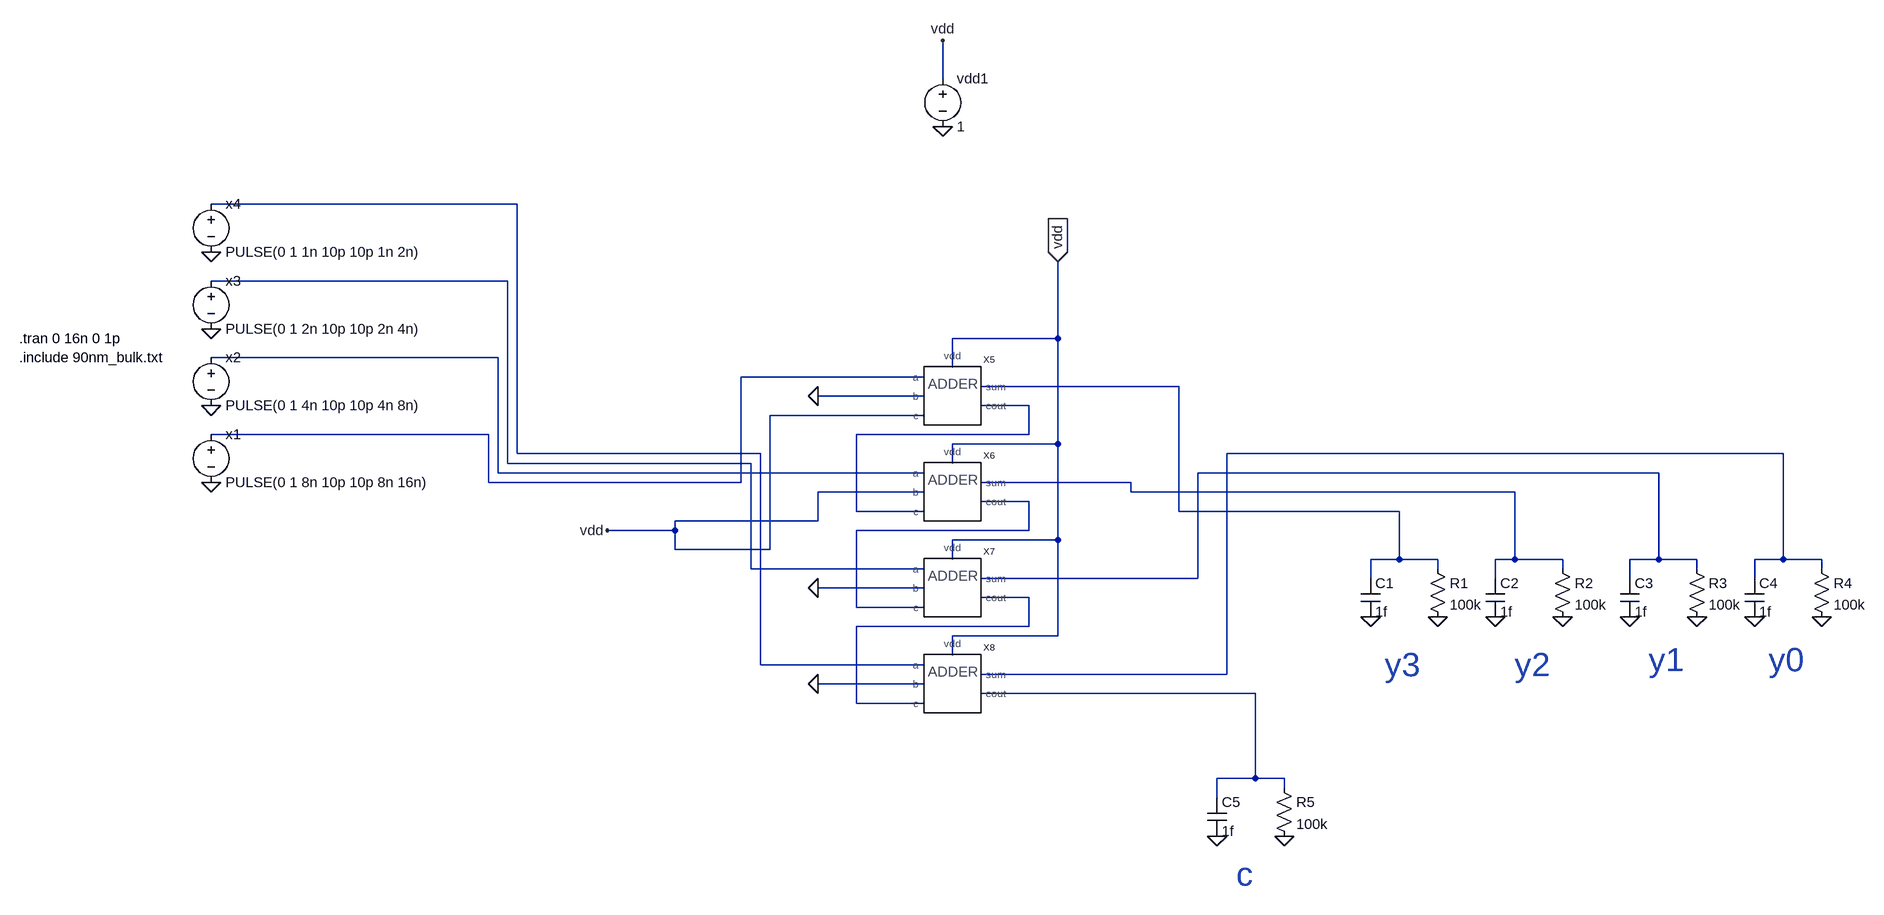
[diagram p0: schematic 4bitAdder-test.asc]
4bitAdder-test.asc, the LTspice schematic file:
Version 4
SHEET 1 4180 1316
WIRE 1552 -512 1552 -576
WIRE 576 -256 -96 -256
WIRE 560 -128 -96 -128
WIRE 1744 -32 1744 -160
WIRE 1744 -32 1568 -32
WIRE 544 0 -96 0
WIRE 1568 16 1568 -32
WIRE 1520 32 1216 32
WIRE 1952 48 1616 48
WIRE 1520 64 1344 64
WIRE 1696 80 1616 80
WIRE 1520 96 1264 96
WIRE 528 128 -96 128
WIRE 1696 128 1696 80
WIRE 1696 128 1408 128
WIRE 1744 144 1744 -32
WIRE 1744 144 1568 144
WIRE 576 160 576 -256
WIRE 1248 160 576 160
WIRE 2960 160 2032 160
WIRE 560 176 560 -128
WIRE 1232 176 560 176
WIRE 1568 176 1568 144
WIRE 544 192 544 0
WIRE 1520 192 544 192
WIRE 2752 192 1984 192
WIRE 528 208 528 128
WIRE 1216 208 1216 32
WIRE 1216 208 528 208
WIRE 1872 208 1616 208
WIRE 1520 224 1344 224
WIRE 1872 224 1872 208
WIRE 2512 224 1872 224
WIRE 1696 240 1616 240
WIRE 1408 256 1408 128
WIRE 1520 256 1408 256
WIRE 1952 256 1952 48
WIRE 2320 256 1952 256
WIRE 1344 272 1344 224
WIRE 1344 272 1056 272
WIRE 1056 288 1056 272
WIRE 1056 288 816 288
WIRE 1696 288 1696 240
WIRE 1696 288 1408 288
WIRE 1744 304 1744 144
WIRE 1744 304 1568 304
WIRE 1056 320 1056 288
WIRE 1264 320 1264 96
WIRE 1264 320 1056 320
WIRE 1568 336 1568 304
WIRE 2320 336 2320 256
WIRE 2320 336 2272 336
WIRE 2384 336 2320 336
WIRE 2512 336 2512 224
WIRE 2512 336 2480 336
WIRE 2592 336 2512 336
WIRE 2752 336 2752 192
WIRE 2752 336 2704 336
WIRE 2816 336 2752 336
WIRE 2960 336 2960 160
WIRE 2960 336 2912 336
WIRE 3024 336 2960 336
WIRE 1232 352 1232 176
WIRE 1520 352 1232 352
WIRE 2384 352 2384 336
WIRE 2592 352 2592 336
WIRE 2816 352 2816 336
WIRE 3024 352 3024 336
WIRE 1984 368 1984 192
WIRE 1984 368 1616 368
WIRE 2272 368 2272 336
WIRE 2480 368 2480 336
WIRE 2704 368 2704 336
WIRE 2912 368 2912 336
WIRE 1520 384 1344 384
WIRE 1696 400 1616 400
WIRE 1408 416 1408 288
WIRE 1520 416 1408 416
WIRE 1696 448 1696 400
WIRE 1696 448 1408 448
WIRE 1744 464 1744 304
WIRE 1744 464 1568 464
WIRE 1568 496 1568 464
WIRE 1248 512 1248 160
WIRE 1520 512 1248 512
WIRE 2032 528 2032 160
WIRE 2032 528 1616 528
WIRE 1520 544 1344 544
WIRE 2080 560 1616 560
WIRE 1408 576 1408 448
WIRE 1520 576 1408 576
WIRE 2080 720 2080 560
WIRE 2080 720 2016 720
WIRE 2128 720 2080 720
WIRE 2128 736 2128 720
WIRE 2016 752 2016 720
FLAG -96 80 0
FLAG -96 208 0
FLAG -96 -48 0
FLAG -96 -176 0
FLAG 1552 -432 0
FLAG 1552 -576 vdd
FLAG 816 288 vdd
FLAG 2272 432 0
FLAG 2384 432 0
FLAG 2480 432 0
FLAG 2592 432 0
FLAG 2704 432 0
FLAG 2816 432 0
FLAG 2912 432 0
FLAG 3024 432 0
FLAG 2016 816 0
FLAG 2128 816 0
FLAG 1744 -160 vdd
IOPIN 1744 -160 In
FLAG 1344 64 0
FLAG 1344 384 0
FLAG 1344 544 0
SYMBOL voltage -96 112 R0
WINDOW 123 0 0 Left 2
WINDOW 39 0 0 Left 2
SYMATTR InstName x1
SYMATTR Value PULSE(0 1 8n 10p 10p 8n 16n)
SYMBOL voltage -96 -16 R0
WINDOW 123 0 0 Left 2
WINDOW 39 0 0 Left 2
SYMATTR InstName x2
SYMATTR Value PULSE(0 1 4n 10p 10p 4n 8n)
SYMBOL voltage -96 -144 R0
WINDOW 123 0 0 Left 2
WINDOW 39 0 0 Left 2
SYMATTR InstName x3
SYMATTR Value PULSE(0 1 2n 10p 10p 2n 4n)
SYMBOL voltage -96 -272 R0
WINDOW 123 0 0 Left 2
WINDOW 39 0 0 Left 2
SYMATTR InstName x4
SYMATTR Value PULSE(0 1 1n 10p 10p 1n 2n)
SYMBOL voltage 1552 -528 R0
WINDOW 123 0 0 Left 2
WINDOW 39 0 0 Left 2
SYMATTR InstName vdd1
SYMATTR Value 1
SYMBOL res 2368 336 R0
SYMATTR InstName R1
SYMATTR Value 100k
SYMBOL cap 2256 368 R0
SYMATTR InstName C1
SYMATTR Value 1f
SYMBOL res 2576 336 R0
SYMATTR InstName R2
SYMATTR Value 100k
SYMBOL cap 2464 368 R0
SYMATTR InstName C2
SYMATTR Value 1f
SYMBOL res 2800 336 R0
SYMATTR InstName R3
SYMATTR Value 100k
SYMBOL cap 2688 368 R0
SYMATTR InstName C3
SYMATTR Value 1f
SYMBOL res 3008 336 R0
SYMATTR InstName R4
SYMATTR Value 100k
SYMBOL cap 2896 368 R0
SYMATTR InstName C4
SYMATTR Value 1f
SYMBOL res 2112 720 R0
SYMATTR InstName R5
SYMATTR Value 100k
SYMBOL cap 2000 752 R0
SYMATTR InstName C5
SYMATTR Value 1f
SYMBOL adder 1568 64 R0
SYMATTR InstName X5
SYMBOL adder 1568 224 R0
SYMATTR InstName X6
SYMBOL adder 1568 384 R0
SYMATTR InstName X7
SYMBOL adder 1568 544 R0
SYMATTR InstName X8
TEXT -416 0 Left 2 !.include 90nm_bulk.txt
TEXT -416 -32 Left 2 !.tran 0 16n 0 1p
TEXT 2936 504 Left 5 ;y0
TEXT 2736 504 Left 5 ;y1
TEXT 2512 512 Left 5 ;y2
TEXT 2296 512 Left 5 ;y3
TEXT 2048 880 Left 5 ;c

The netlist it stands for:
* 4bitAdder-test.asc
V§x1 N004 0 PULSE(0 1 8n 10p 10p 8n 16n)
V§x2 N003 0 PULSE(0 1 4n 10p 10p 4n 8n)
V§x3 N002 0 PULSE(0 1 2n 10p 10p 2n 4n)
V§x4 N001 0 PULSE(0 1 1n 10p 10p 1n 2n)
vdd1 vdd 0 1
R1 N005 0 100k
C1 N005 0 1f
R2 N009 0 100k
C2 N009 0 1f
R3 N008 0 100k
C3 N008 0 1f
R4 N007 0 100k
C4 N007 0 1f
R5 N012 0 100k
C5 N012 0 1f
XX5 N004 0 vdd vdd N005 N006 adder  ; pins a b c vdd sum cout
XX6 N003 vdd N006 vdd N009 N010 adder  ; pins a b c vdd sum cout
XX7 N002 0 N010 vdd N008 N011 adder  ; pins a b c vdd sum cout
XX8 N001 0 N011 vdd N007 N012 adder  ; pins a b c vdd sum cout
.include 90nm_bulk.txt
.tran 0 16n 0 1p
* y0
* y1
* y2
* y3
* c
.backanno
.end